# EAGLE schematic xmas_id_badge_0.12 (EAGLE 9.2.2)
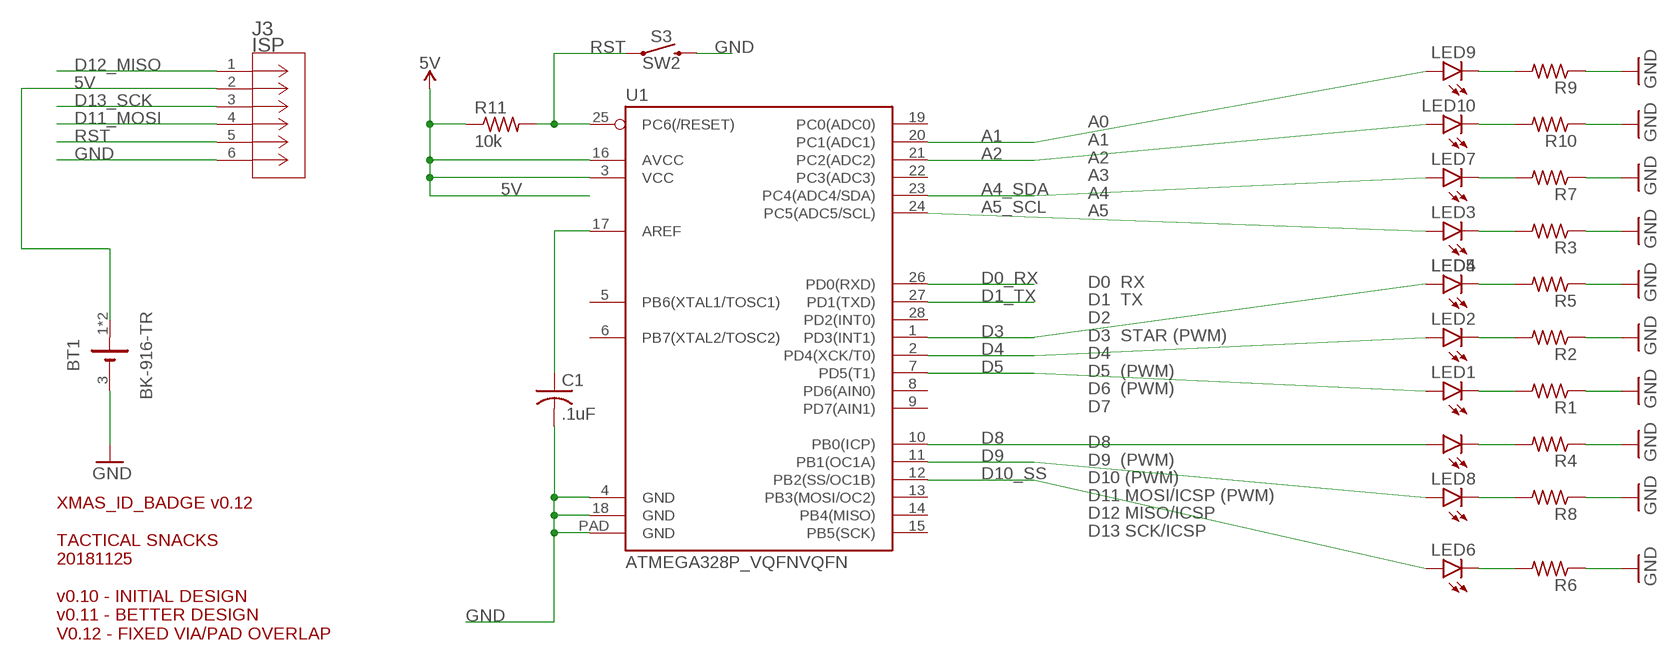
[diagram p0: schematic, sheet 1]

## Parts
BT1  BK-916-TR  [BAT_BK-916-TR]
C1  .1uF  C-USC0603  [C0603]
J3  ISP  FTSH-103-01-F-DVCON6_2X3_DU_FTSH-L_REV  [CON6_2X3_DU_FTSH-L_REV]
LED1  LEDCHIP-LED0805  [CHIP-LED0805]
LED2  LEDCHIP-LED0805  [CHIP-LED0805]
LED3  LEDCHIP-LED0805  [CHIP-LED0805]
LED4  LEDCHIP-LED0805  [CHIP-LED0805]
LED5  LEDCHIP-LED0805  [CHIP-LED0805]
LED6  LEDCHIP-LED0805  [CHIP-LED0805]
LED7  LEDCHIP-LED0805  [CHIP-LED0805]
LED8  LEDCHIP-LED0805  [CHIP-LED0805]
LED9  LEDCHIP-LED0805  [CHIP-LED0805]
LED10  LEDCHIP-LED0805  [CHIP-LED0805]
R1  R-US_R0603  [R0603]
R2  R-US_R0603  [R0603]
R3  R-US_R0603  [R0603]
R4  R-US_R0603  [R0603]
R5  R-US_R0603  [R0603]
R6  R-US_R0603  [R0603]
R7  R-US_R0603  [R0603]
R8  R-US_R0603  [R0603]
R9  R-US_R0603  [R0603]
R10  R-US_R0603  [R0603]
R11  10k  R-US_R0805  [R0805]
S3  SW2  MOMENTARY-SWITCH-SPST-SMD-6.0X3.5MM  [TACTILE_SWITCH_SMD_6.0X3.5MM]
U1  ATMEGA328P_VQFNVQFN  [VQFN-28]

## Nets
5V [pwr]: BT1.1(+) BT1.2(+) J3.2 R11.1 U1.3(VCC) U1.16(AVCC)
A1: LED9.A U1.20(PC1(ADC1))
A2: LED10.A U1.21(PC2(ADC2))
A4_SDA: LED7.A U1.23(PC4(ADC4/SDA))
A5_SCL: LED3.A U1.24(PC5(ADC5/SCL))
D0_RX [uart]: U1.26(PD0(RXD))
D1_TX [uart]: U1.27(PD1(TXD))
D3: LED5.A U1.1(PD3(INT1))
D4: LED2.A U1.2(PD4(XCK/T0))
D5: LED1.A U1.7(PD5(T1))
D8: LED4.A U1.10(PB0(ICP))
D9: LED8.A U1.11(PB1(OC1A))
D10_SS: LED6.A U1.12(PB2(SS/OC1B))
D11_MOSI: J3.4
D12_MISO: J3.1
D13_SCK: J3.3
GND: BT1.3(-) C1.2 J3.6 R1.1 R2.1 R3.1 R4.1 R5.1 R6.1 R7.1 R8.1 R9.1 R10.1 S3.2 U1.4(GND) U1.18(GND) U1.PAD(GND)
N$1: LED1.C R1.2
N$2: C1.1 U1.17(AREF)
N$3: LED2.C R2.2
N$5: LED3.C R3.2
N$7: LED4.C R4.2
N$8: LED6.C R6.2
N$9: LED5.C R5.2
N$10: LED7.C R7.2
N$11: LED8.C R8.2
N$12: LED9.C R9.2
N$13: LED10.C R10.2
RST: J3.5 R11.2 S3.1 U1.25(PC6(/RESET))
Unconnected: U1.5(PB6(XTAL1/TOSC1)) U1.6(PB7(XTAL2/TOSC2)) U1.8(PD6(AIN0)) U1.9(PD7(AIN1)) U1.13(PB3(MOSI/OC2)) U1.14(PB4(MISO)) U1.15(PB5(SCK)) U1.19(PC0(ADC0)) U1.22(PC3(ADC3)) U1.28(PD2(INT0))

## Notes on the sheet
- A0  
  A1  
  A2  
  A3  
  A4  
  A5  
  
  
  
  D0  RX
  D1  TX
  D2  
  D3  STAR (PWM)
  D4  
  D5  (PWM)
  D6  (PWM)
  D7  
  
  D8  
  D9  (PWM)
  D10 (PWM)
  D11 MOSI/ICSP (PWM)
  D12 MISO/ICSP
  D13 SCK/ICSP
- XMAS_ID_BADGE v0.12
  
  TACTICAL SNACKS
  20181125
  
  v0.10 - INITIAL DESIGN
  v0.11 - BETTER DESIGN
  V0.12 - FIXED VIA/PAD OVERLAP

## Library data of the parts
BT1 = BK-916-TR:BK-916-TR: Cr1220, 1225 Battery Retainer w/; DESCRIPTION: Cr1220, 1225 Battery Retainer w/; DIGI-KEY_PART_NUMBER: BK-916-CT-ND; DIGI-KEY_PURCHASE_URL: https://www.digikey.com/product-detail/en/mpd-memory-protection-devices/BK-916-TR/BK-916-CT-ND/6200238?utm_source=snapeda&utm_medium=aggregator&utm_campaign=symbol; MF: MPD _Memory; MP: BK-916-TR; PACKAGE: MSOP-12 Memory Protection Devices
C1 = rcl:C-US: CAPACITOR, American symbol; SPICEPREFIX: C
J3 = con-samtec2:FTSH-103-01-F-DV
LED1-LED10 = led:LED: LED OSRAM: - CHIPLED LG R971, LG N971, LY N971, LG Q971, LY Q971, LO R971, LY R971 LH N974, LH R974 LS Q976, LO Q976, LY Q976 LO Q996 - Hyper CHIPLED LW Q18S LB Q993, LB Q99A, LB R99A - SideLED LS A670, LO A670, LY A670, LG A670, LP A670 LB A673, LV A673, LT A673, LW A673 LH A674 LY A675 LS A676, LA A676, LO A676, LY A676, LW A676 LS A679, LY A679, LG A679 - Hyper Micro SIDELED® LS Y876, LA Y876, LO Y876, LY Y876 LT Y87S - SmartLED LW L88C, LW L88S LB L89C, LB L89S, LG L890 LS L89K, LO L89K, LY L89K LS L896, LA L896, LO L896, LY L896 - TOPLED LS T670, LO T670, LY T670, LG T670, LP T670 LSG T670, LSP T670, LSY T670, LOP T670, LYG T670 LG T671, LOG T671, LSG T671 LB T673, LV T673, LT T673, LW T673 LH T674 LS T676, LA T676, LO T676, LY T676, LB T676, LH T676, LSB T676, LW T676 LB T67C, LV T67C, LT T67C, LS T67K, LO T67K, LY T67K, LW E67C LS E67B, LA E67B, LO E67B, LY E67B, LB E67C, LV E67C, LT E67C LW T67C LS T679, LY T679, LG T679 LS T770, LO T770, LY T770, LG T770, LP T770 LB T773, LV T773, LT T773, LW T773 LH T774 LS E675, LA E675, LY E675, LS T675 LS T776, LA T776, LO T776, LY T776, LB T776 LHGB T686 LT T68C, LB T68C - Hyper Mini TOPLED® LB M676 - Mini TOPLED Santana® LG M470 LS M47K, LO M47K, LY M47K Source: http://www.osram.convergy.de LUXEON: - LUMILED® LXK2-PW12-R00, LXK2-PW12-S00, LXK2-PW14-U00, LXK2-PW14-V00 LXK2-PM12-R00, LXK2-PM12-S00, LXK2-PM14-U00 LXK2-PE12-Q00, LXK2-PE12-R00, LXK2-PE12-S00, LXK2-PE14-T00, LXK2-PE14-U00 LXK2-PB12-K00, LXK2-PB12-L00, LXK2-PB12-M00, LXK2-PB14-N00, LXK2-PB14-P00, LXK2-PB14-Q00 LXK2-PR12-L00, LXK2-PR12-M00, LXK2-PR14-Q00, LXK2-PR14-R00 LXK2-PD12-Q00, LXK2-PD12-R00, LXK2-PD12-S00 LXK2-PH12-R00, LXK2-PH12-S00 LXK2-PL12-P00, LXK2-PL12-Q00, LXK2-PL12-R00 Source: www.luxeon.com KINGBRIGHT: KA-3528ASYC Source: www.kingbright.com
R1-R10 = rcl:R-US_: RESISTOR, American symbol; SPICEPREFIX: R
R11 = adafruit:R-US_: RESISTOR, American symbol
S3 = SparkFun-Switches:MOMENTARY-SWITCH-SPST: Momentary Switch (Pushbutton) - SPST Normally-open (NO) SPST momentary switches (buttons, pushbuttons). Variants PTH-12MM - 12mm square, through-hole Momentary Pushbutton Switch - 12mm Square <https://www.sparkfun.com/products/9190> (COM-09190) PTH-6.0MM, PTH-6.0MM-KIT - 6.0mm square, through-hole Mini Pushbutton Switch <https://www.sparkfun.com/products/97> (COM-00097) KIT package intended for soldering kit's - only one side of pads' copper is exposed. PTH-RIGHT-ANGLE-KIT - Right-angle, through-hole Right Angle Tactile Button <https://www.sparkfun.com/products/10791> - Used on SparkFun BigTime Watch Kit <https://www.sparkfun.com/products/11734> SMD-12MM - 12mm square, surface-mount Tactile Button - SMD (12mm) <https://www.sparkfun.com/products/12993> (COM-12993) Used on SparkFun PicoBoard <https://www.sparkfun.com/products/11888> SMD-4.5MM - 4.5mm Square Trackball Switch Used on SparkFun Blackberry Trackballer Breakout <https://www.sparkfun.com/products/13169> SMD-4.6MMX2.8MM - 4.60mm x 2.80mm, surface mount Used on SparkFun SAMD21 Mini Breakout <https://www.sparkfun.com/products/13664> SMD-5.2MM, SMD-5.2-REDUNDANT - 5.2mm square, surface-mount Mini Pushbutton Switch - SMD <https://www.sparkfun.com/products/8720> (COM-08720) Used on Arduino Pro Mini <https://www.sparkfun.com/products/11114> REDUNDANT package connects both switch circuits together SMD-6.0X3.5MM - 6.0 x 3.5mm, surface mount Momentary Reset Switch SMD <https://www.sparkfun.com/products/8229> (COM-08229) SMD-6.2MM-TALL - 6.2mm square, surface mount Tactile Button - SMD (6mm) <https://www.sparkfun.com/products/12992> Used on SparkFun Digital Sandbox <https://www.sparkfun.com/products/12651> SMD-RIGHT-ANGLE - Right-angle, surface mount Used on SparkFun Block for Intel® Edison - Arduino <https://www.sparkfun.com/products/13036>; PROD_ID: SWCH-00815; SF_SKU: COM-08229
U1 = SparkFun-IC-Microcontroller:ATMEGA328P_VQFN: Atmel 328P QFN part not in catalog

## Net classes
0 default: width 0.152 mm
1 pwr: width 0.203 mm
2 pwr24: width 0.203 mm
3 uart: width 0.203 mm, clearance 0.152 mm